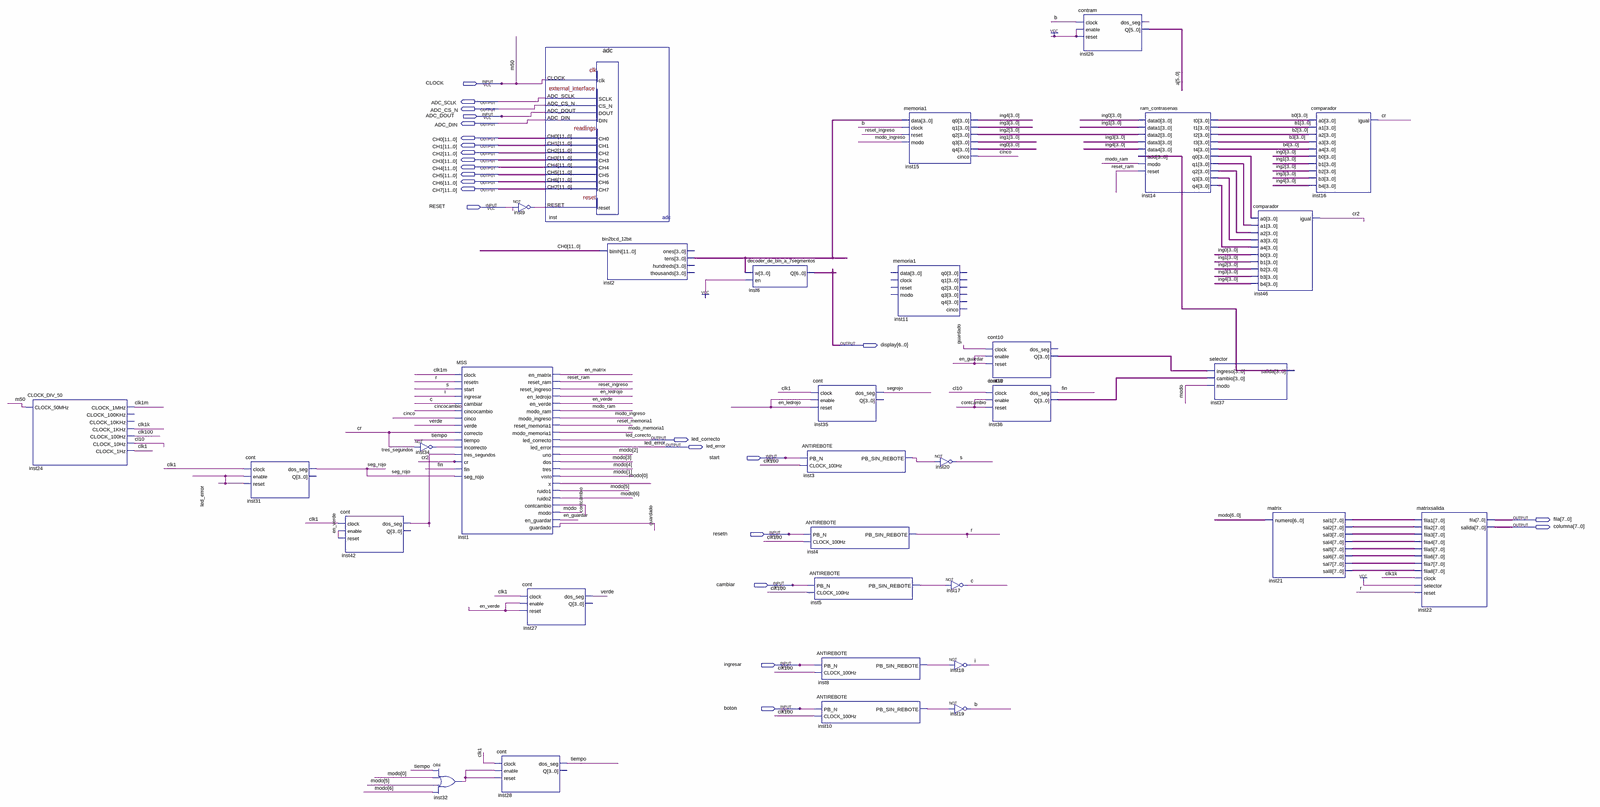
[diagram p0: schematic sheet, whole]
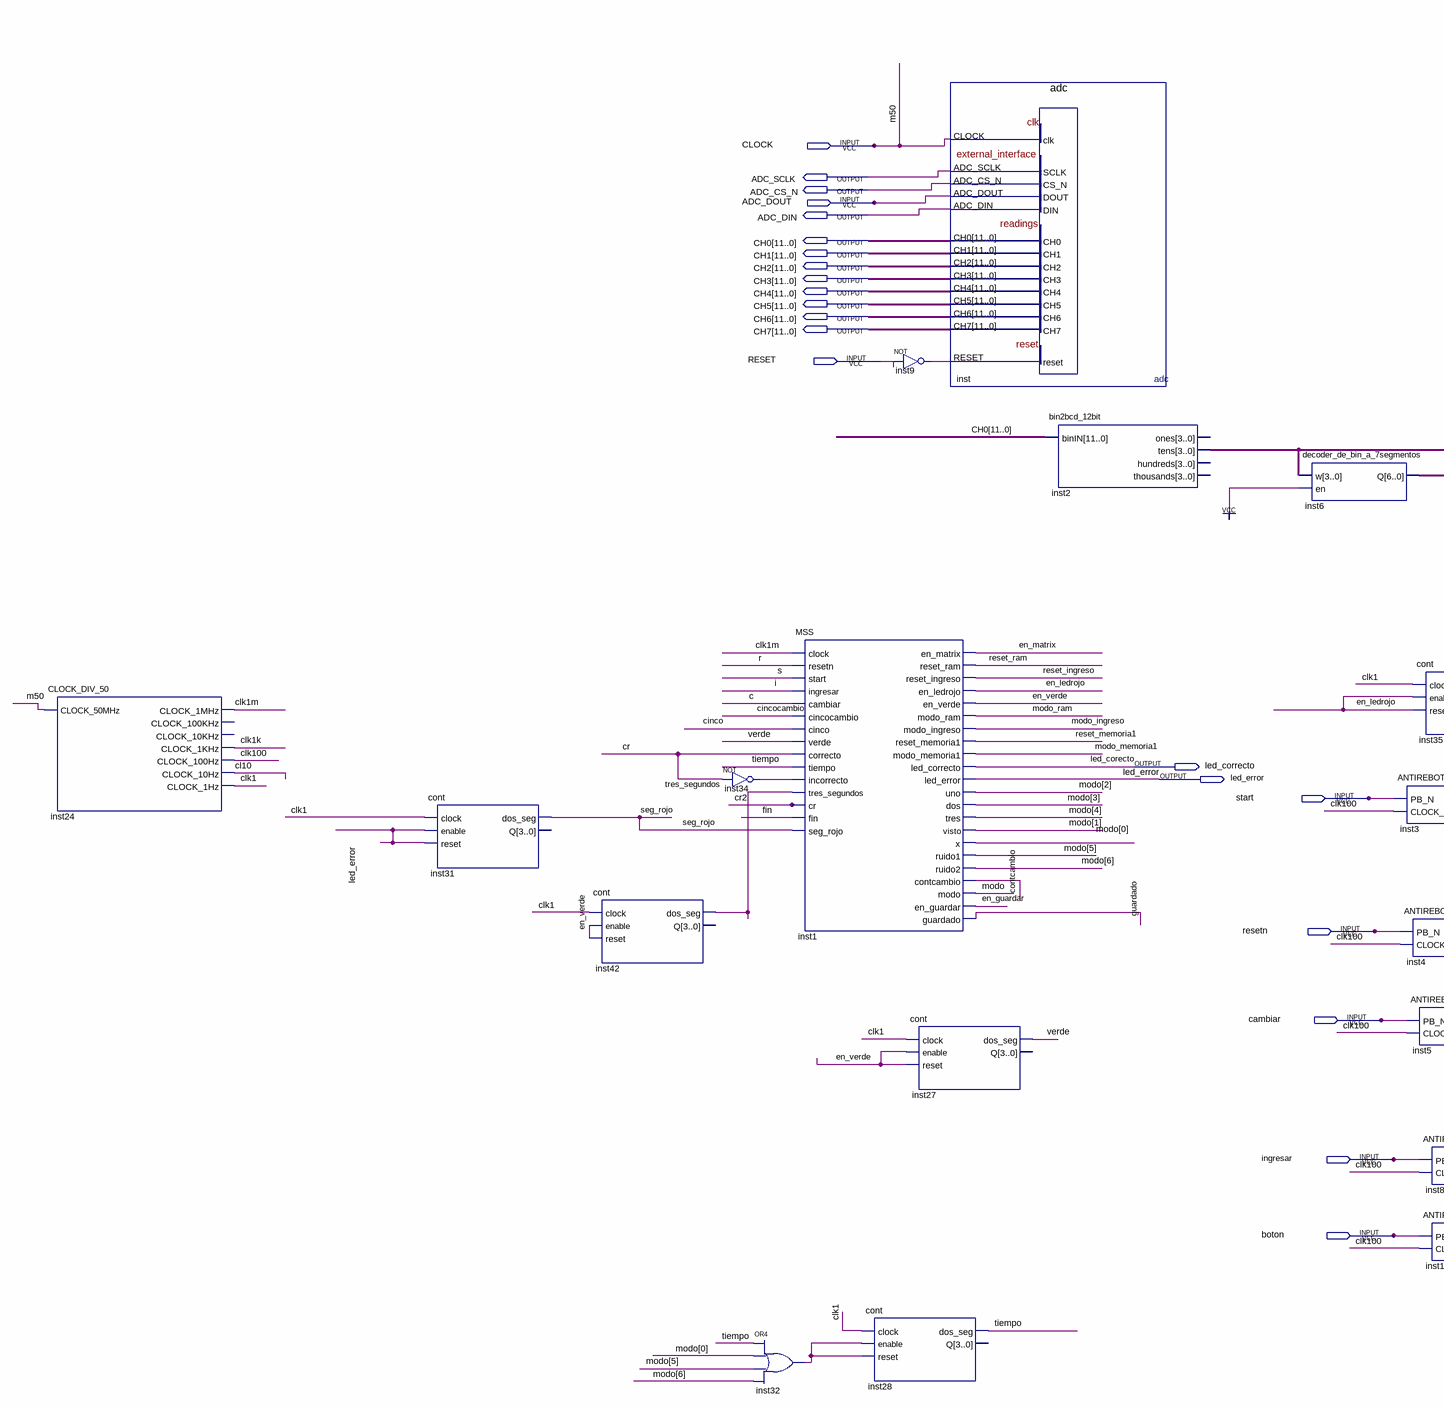
[diagram p1: schematic sheet, left part]
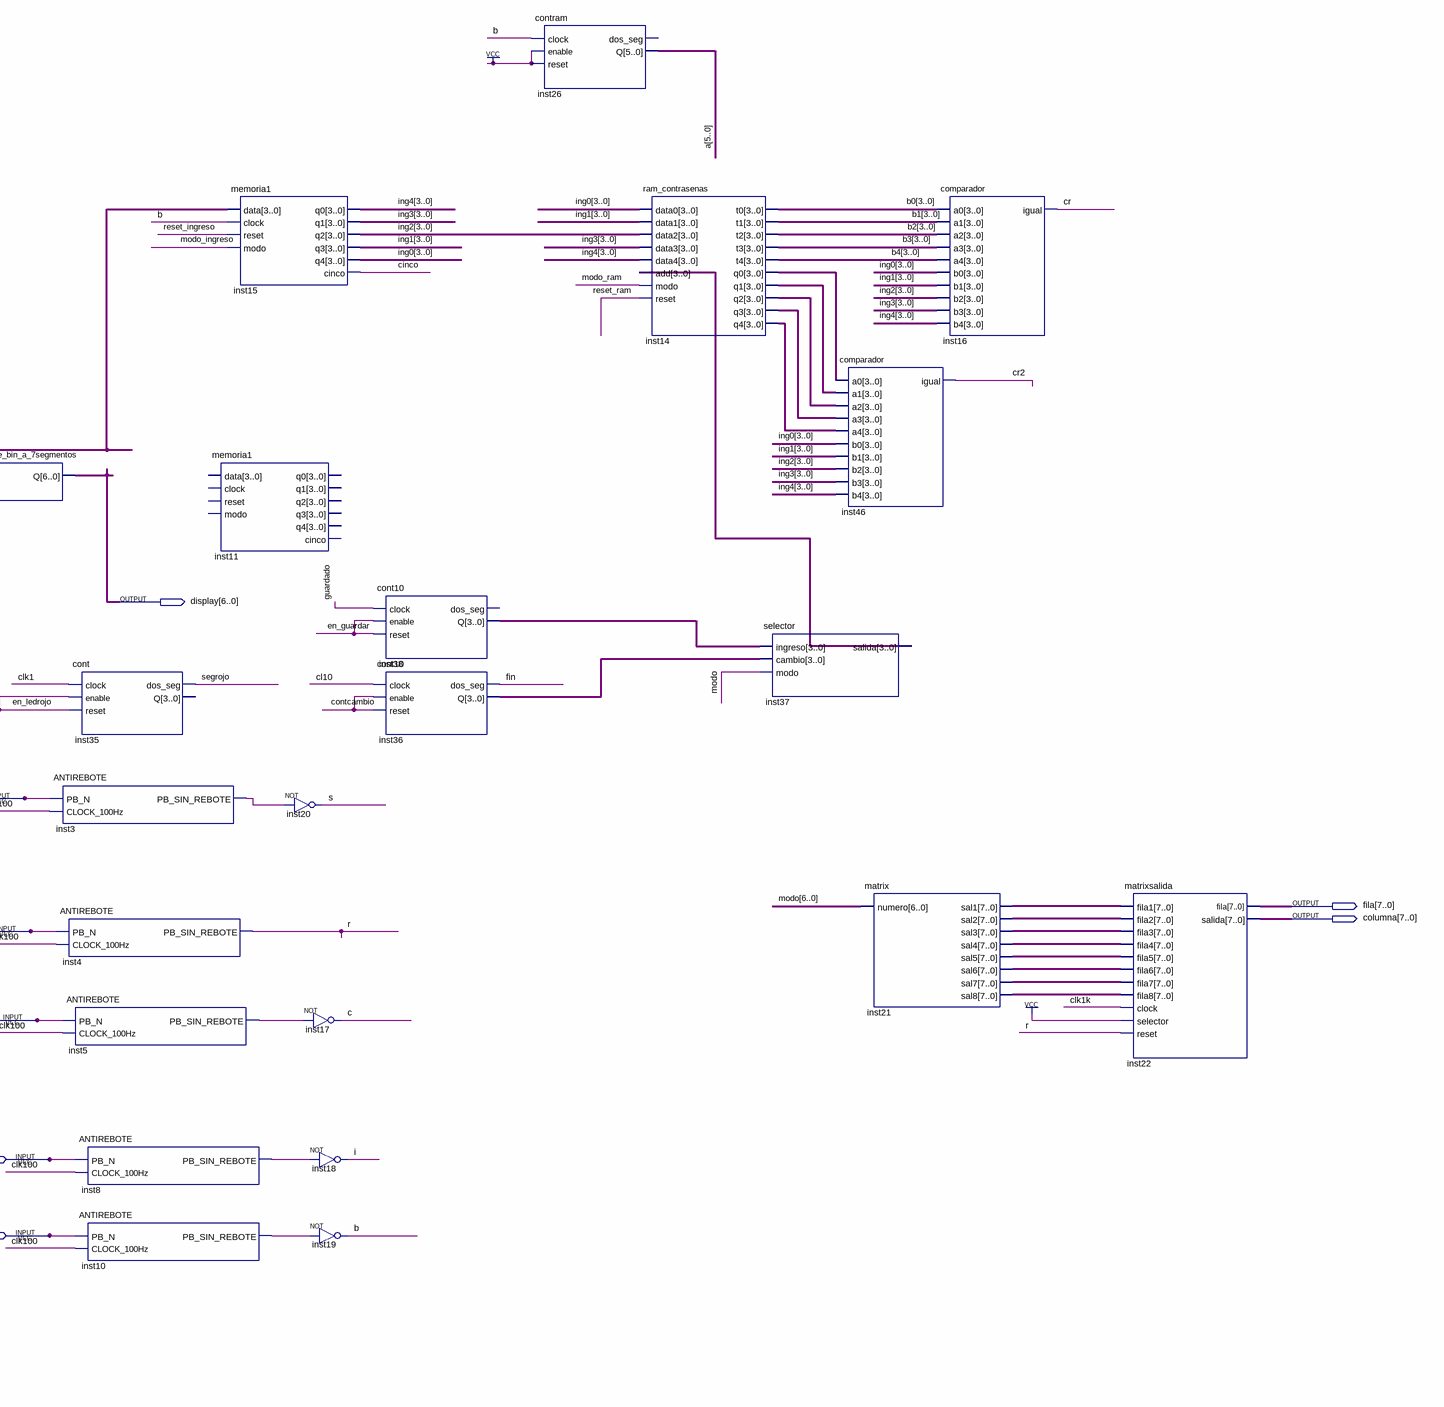
[diagram p2: schematic sheet, right part]
// Quartus schematic proyect.bdf as structural Verilog: 33 symbols, 24 pins
module proyect (
  input  CLOCK,
  input  ADC_DOUT,
  input  RESET,
  input  start,
  input  resetn,
  input  cambiar,
  input  ingresar,
  input  boton,
  output ADC_SCLK,
  output ADC_CS_N,
  output ADC_DIN,
  output [11:0] CH0,
  output [11:0] CH1,
  output [11:0] CH2,
  output [11:0] CH3,
  output [11:0] CH4,
  output [11:0] CH5,
  output [11:0] CH6,
  output [11:0] CH7,
  output [6:0] display,
  output led_correcto,
  output led_error,
  output [7:0] fila,
  output [7:0] columna
);

  wire b, c, cinco, cincocambio, cl10, clk1, clk1k, clk1m, clk100, contcambio, cr, cr2, en_guardar,
       en_ledrojo, en_matrix, en_verde, fin, guardado, i, inst3_pb_sin_rebote, inst5_pb_sin_rebote,
       inst8_pb_sin_rebote, inst9_out, inst10_pb_sin_rebote, inst32_out, inst34_out, modo_1bit, modo_ingreso,
       modo_memoria1, modo_ram, r, reset_ingreso, reset_memoria1, reset_ram, s, seg_rojo, segrojo, tiempo,
       tres_segundos, verde;
  wire [3:0] b0, b1, b2, b3, b4, ing0, ing1, ing2, ing3, ing4, inst2_tens, inst14_q0, inst14_q1, inst14_q2,
       inst14_q3, inst14_q4, inst36_q, inst37_salida, inst38_q;
  wire [5:0] a;
  wire [6:0] modo;
  wire [7:0] inst21_sal1, inst21_sal2, inst21_sal3, inst21_sal4, inst21_sal5, inst21_sal6, inst21_sal7,
       inst21_sal8;

  CLOCK_DIV_50 inst24 (
    .CLOCK_50MHz(CLOCK), .CLOCK_1MHz(clk1m), .CLOCK_1KHz(clk1k), .CLOCK_100Hz(clk100), .CLOCK_10Hz(cl10),
    .CLOCK_1Hz(clk1));  // open: CLOCK_100KHz, CLOCK_10KHz
  cont inst31 (.clock(clk1), .enable(led_error), .reset(led_error), .dos_seg(seg_rojo));  // open: Q
  cont inst42 (.clock(clk1), .enable(en_verde), .reset(en_verde), .dos_seg(tres_segundos));  // open: Q
  not inst34 (inst34_out, cr);
  MSS inst1 (
    .clock(clk1m), .resetn(r), .start(s), .ingresar(i), .cambiar(c), .cincocambio(cincocambio),
    .cinco(cinco), .verde(verde), .correcto(cr), .tiempo(tiempo), .incorrecto(inst34_out),
    .tres_segundos(tres_segundos), .cr(cr2), .fin(fin), .seg_rojo(seg_rojo), .en_matrix(en_matrix),
    .reset_ram(reset_ram), .reset_ingreso(reset_ingreso), .en_ledrojo(en_ledrojo), .en_verde(en_verde),
    .modo_ram(modo_ram), .modo_ingreso(modo_ingreso), .reset_memoria1(reset_memoria1),
    .modo_memoria1(modo_memoria1), .led_correcto(led_correcto), .led_error(led_error), .uno(modo[2]),
    .dos(modo[3]), .tres(modo[4]), .visto(modo[1]), .x(modo[0]), .ruido1(modo[5]), .ruido2(modo[6]),
    .contcambio(contcambio), .modo(modo_1bit), .en_guardar(en_guardar), .guardado(guardado));
  or inst32 (inst32_out, tiempo, modo[0], modo[5], modo[6]);
  not inst9 (inst9_out, RESET);
  cont inst28 (.clock(clk1), .enable(inst32_out), .reset(inst32_out), .dos_seg(tiempo));  // open: Q
  adc inst (
    .CLOCK(CLOCK), .ADC_DOUT(ADC_DOUT), .RESET(inst9_out), .ADC_SCLK(ADC_SCLK), .ADC_CS_N(ADC_CS_N),
    .ADC_DIN(ADC_DIN), .CH0(CH0), .CH1(CH1), .CH2(CH2), .CH3(CH3), .CH4(CH4), .CH5(CH5), .CH6(CH6), .CH7(CH7));
  cont inst27 (.clock(clk1), .enable(en_verde), .reset(en_verde), .dos_seg(verde));  // open: Q
  bin2bcd_12bit inst2 (.binIN(CH0), .tens(inst2_tens));  // open: ones, hundreds, thousands
  decoder_de_bin_a_7segmentos inst6 (.w(inst2_tens), .en(1'b1), .Q(display));
  ANTIREBOTE inst3 (.PB_N(start), .CLOCK_100Hz(clk100), .PB_SIN_REBOTE(inst3_pb_sin_rebote));
  ANTIREBOTE inst4 (.PB_N(resetn), .CLOCK_100Hz(clk100), .PB_SIN_REBOTE(r));
  ANTIREBOTE inst5 (.PB_N(cambiar), .CLOCK_100Hz(clk100), .PB_SIN_REBOTE(inst5_pb_sin_rebote));
  cont inst35 (.clock(clk1), .enable(en_ledrojo), .reset(en_ledrojo), .dos_seg(segrojo));  // open: Q
  ANTIREBOTE inst8 (.PB_N(ingresar), .CLOCK_100Hz(clk100), .PB_SIN_REBOTE(inst8_pb_sin_rebote));
  ANTIREBOTE inst10 (.PB_N(boton), .CLOCK_100Hz(clk100), .PB_SIN_REBOTE(inst10_pb_sin_rebote));
  memoria1 inst11 ();  // open: data, clock, reset, modo, q0, q1, q2, q3, q4, cinco
  memoria1 inst15 (
    .data(inst2_tens), .clock(b), .reset(reset_ingreso), .modo(modo_ingreso), .q0(ing4), .q1(ing3),
    .q2(ing2), .q3(ing1), .q4(ing0), .cinco(cinco));
  not inst20 (s, inst3_pb_sin_rebote);
  not inst17 (c, inst5_pb_sin_rebote);
  not inst18 (i, inst8_pb_sin_rebote);
  not inst19 (b, inst10_pb_sin_rebote);
  cont10 inst38 (.clock(guardado), .enable(en_guardar), .reset(en_guardar), .Q(inst38_q));  // open: dos_seg
  cont10 inst36 (.clock(cl10), .enable(contcambio), .reset(contcambio), .dos_seg(fin), .Q(inst36_q));
  contram inst26 (.clock(b), .enable(1'b1), .reset(1'b1), .Q(a));  // open: dos_seg
  ram_contrasenas inst14 (
    .data0(ing0), .data1(ing1), .data2(ing2), .data3(ing3), .data4(ing4), .add(inst37_salida),
    .modo(modo_ram), .reset(reset_ram), .t0(b0), .t1(b1), .t2(b2), .t3(b3), .t4(b4), .q0(inst14_q0),
    .q1(inst14_q1), .q2(inst14_q2), .q3(inst14_q3), .q4(inst14_q4));
  selector inst37 (.ingreso(inst38_q), .cambio(inst36_q), .modo(modo_1bit), .salida(inst37_salida));
  comparador inst46 (
    .a0(inst14_q0), .a1(inst14_q1), .a2(inst14_q2), .a3(inst14_q3), .a4(inst14_q4), .b0(ing0), .b1(ing1),
    .b2(ing2), .b3(ing3), .b4(ing4), .igual(cr2));
  matrix inst21 (
    .numero(modo), .sal1(inst21_sal1), .sal2(inst21_sal2), .sal3(inst21_sal3), .sal4(inst21_sal4),
    .sal5(inst21_sal5), .sal6(inst21_sal6), .sal7(inst21_sal7), .sal8(inst21_sal8));
  comparador inst16 (
    .a0(b0), .a1(b1), .a2(b2), .a3(b3), .a4(b4), .b0(ing0), .b1(ing1), .b2(ing2), .b3(ing3), .b4(ing4),
    .igual(cr));
  matrixsalida inst22 (
    .fila1(inst21_sal1), .fila2(inst21_sal2), .fila3(inst21_sal3), .fila4(inst21_sal4), .fila5(inst21_sal5),
    .fila6(inst21_sal6), .fila7(inst21_sal7), .fila8(inst21_sal8), .clock(clk1k), .selector(1'b1), .reset(r),
    .fila(fila), .salida(columna));

  // Other names for the same wires on the sheet: led_corecto = led_correcto; m50 = CLOCK
endmodule
